# Altium schematic sheet SAMW25_Xplained_Pro_WIFI_module.SchDoc: Target MCU
size A3; Organization: ATMEL Norway; Address1: Vestre Rosten 79; Address2: N-7075 TILLER; Address3: NORWAY; DocumentNumber: A09-2449; Revision: 1; SheetNumber: 3; SheetTotal: 5; PageSetup: Record=PageOptions|CenterHorizontal=True|CenterVertical=True|PrintScale=1.01|XCorrection=1.00|YCorrection=1.00|PrintKind=1|BorderSize=5000000|LeftOffset=0|BottomOffset=0|Orientation=2|PaperLength=1000|PaperWidth=1000|Scale=100|PaperSource=7|PrintQuality=-4|MediaType=1|DitherType=10|PaperKind=A3 (297 x 420 mm)|PrintScaleMode=1
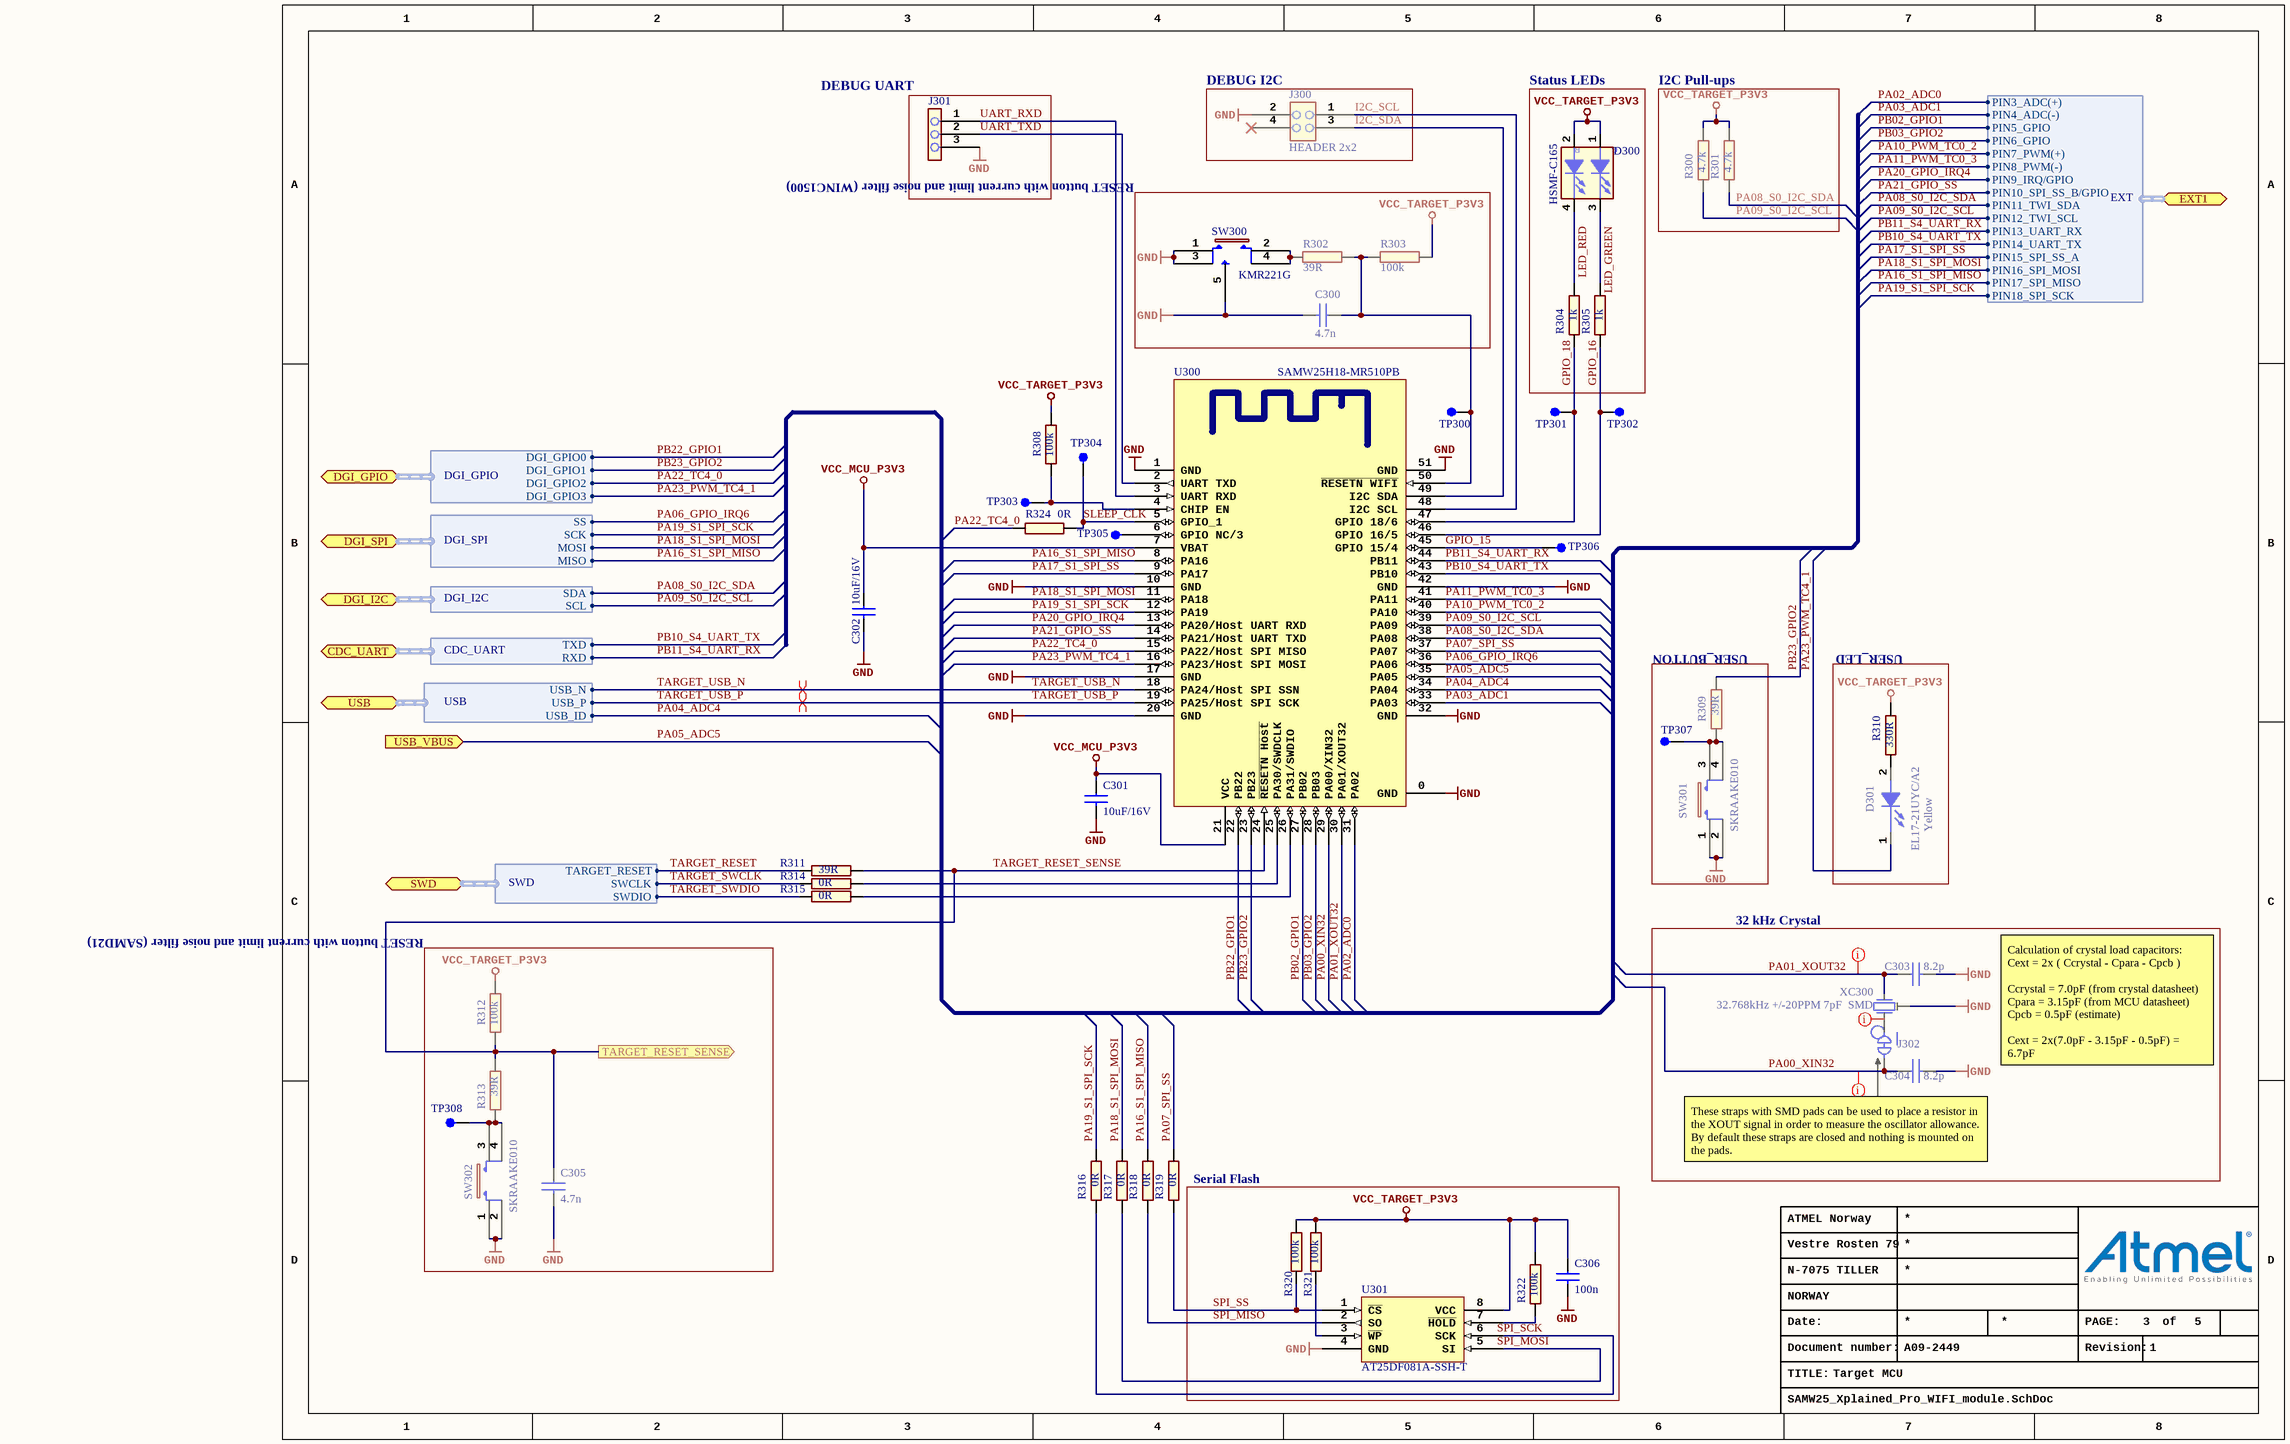
[diagram p0: SAMW25_Xplained_Pro_WIFI_module.SchDoc]

## Parts
C300  4.7n  [AP1-00001]
C301  value 10uF/16V  [AP1-00039]  (hidden comment: CAP-NONPOL)
C302  value 10uF/16V  [AP1-00039]  (hidden comment: CAP-NONPOL)
C303  value 8.2p  [AP1-00001]  (hidden comment: CAP-NONPOL)
C304  value 8.2p  [AP1-00001]  (hidden comment: CAP-NONPOL)
C305  4.7n  [AP1-00053]
C306  100n  [AP1-00001]
D300  value HSMF-C165  [AP4-00132]  (hidden comment: LED2_2)
D301  Yellow  value EL17-21UYC/A2  [AP4-00013]
J300  HEADER 2x2  [AP8-00179]
J301  Same as A08-1614 but with 1mm hole for optimal reflow soldering (no misalignment of the component)  [AP8-00745]  (value not drawn)
J302  SMD-STRAP_CLOSED  [AP8-00595]  (value not drawn)  (net tie, no BOM)
R300  value 4.7k  [AP2-00000]  (hidden comment: R2)
R301  value 4.7k  [AP2-00000]  (hidden comment: R2)
R302  value 39R  [AP2-00000]  (hidden comment: R2)
R303  value 100k  [AP2-00000]  (hidden comment: R2)
R304  value 1k  [AP2-00000]  (hidden comment: R2)
R305  value 1k  [AP2-00000]  (hidden comment: R2)
R308  value 100k  [AP2-00000]  (hidden comment: R2)
R309  value 39R  [AP2-00011]  (hidden comment: R2)
R310  value 330R  [AP2-00000]  (hidden comment: R2)
R311  value 39R  [AP2-00011]  (hidden comment: R2)
R312  value 100k  [AP2-00011]  (hidden comment: R2)
R313  value 39R  [AP2-00011]  (hidden comment: R2)
R314  value 0R  [AP2-00000]  (hidden comment: R2)
R315  value 0R  [AP2-00000]  (hidden comment: R2)
R316  value 0R  [AP2-00000]  (hidden comment: R2)
R317  value 0R  [AP2-00000]  (hidden comment: R2)
R318  value 0R  [AP2-00000]  (hidden comment: R2)
R319  value 0R  [AP2-00000]  (hidden comment: R2)
R320  value 100k  [AP2-00000]  (hidden comment: R2)
R321  value 100k  [AP2-00000]  (hidden comment: R2)
R322  value 100k  [AP2-00000]  (hidden comment: R2)
R324  value 0R  [AP2-00011]  (hidden comment: R2)
SW300  value KMR221G  [AP8-00274]  (hidden comment: PUSHBUTTON2)
SW301  value SKRAAKE010  [AP8-00137]  (hidden comment: Can be ordered in low volumes from Mouser)
SW302  value SKRAAKE010  [AP8-00137]  (hidden comment: Can be ordered in low volumes from Mouser)
TP300  TESTPOINT  [AP8-00256]  (value not drawn)  (no BOM)
TP301  TESTPOINT  [AP8-00256]  (value not drawn)  (no BOM)
TP302  TESTPOINT  [AP8-00256]  (value not drawn)  (no BOM)
TP303  TESTPOINT  [AP8-00256]  (value not drawn)  (no BOM)
TP304  TESTPOINT  [AP8-00256]  (value not drawn)  (no BOM)
TP305  TESTPOINT  [AP8-00256]  (value not drawn)  (no BOM)
TP306  TESTPOINT  [AP8-00256]  (value not drawn)  (no BOM)
TP307  TESTPOINT  [AP8-00010]  (value not drawn)  (no BOM)
TP308  TESTPOINT  [AP8-00010]  (value not drawn)  (no BOM)
U300  value SAMW25H18-MR510PB  [AP9-00132]  (hidden comment: MR210PA)
U301  value AT25DF081A-SSH-T  [AP8-00417]  (hidden comment: AT25DF081A)
XC300  value 32.768kHz +/-20PPM 7pF  SMD  [AP7-00044]  (hidden comment: Farnell order no:1539364)

## Blocks framed on the sheet
DEBUG I2C: J300
Status LEDs: D300 R304 R305
I2C Pull-ups: R300 R301
RESET button with current limit and noise filter (WINC1500): C300 R302 R303 SW300
USER_BUTTON: R309 SW301 TP307
USER_LED: D301 R310
RESET button with current limit and noise filter (SAMD21): C305 R312 R313 SW302 TP308
32 kHz Crystal: C303 C304 J302 XC300
Serial Flash: C306 R320-R322 U301

## Ports
CDC_UART (harness CDC_UART), DGI_GPIO (harness DGI_GPIO), DGI_I2C (harness DGI_I2C), DGI_SPI (harness DGI_SPI), EXT1 (harness EXT), SWD (harness SWD), TARGET_RESET_SENSE (out), USB (harness USB), USB_VBUS (in)

## Harnesses
DGI_GPIO: DGI_GPIO0, DGI_GPIO1, DGI_GPIO2, DGI_GPIO3
DGI_SPI: MISO, MOSI, SCK, SS
DGI_I2C: SCL, SDA
CDC_UART: RXD, TXD
SWD: SWCLK, SWDIO, TARGET_RESET
USB: USB_ID, USB_N, USB_P
EXT: PIN10_SPI_SS_B/GPIO, PIN11_TWI_SDA, PIN12_TWI_SCL, PIN13_UART_RX, PIN14_UART_TX, PIN15_SPI_SS_A, PIN16_SPI_MOSI, PIN17_SPI_MISO, PIN18_SPI_SCK, PIN3_ADC(+), PIN4_ADC(-), PIN5_GPIO, PIN6_GPIO, PIN7_PWM(+), PIN8_PWM(-), PIN9_IRQ/GPIO

## Nets
GND: C300.2 C301.2 C302.2 C303.2 C304.2 C305.2 C306.2 J300.2 J301.3 SW300.1 SW300.3 SW300.5(GND) SW301.1 SW301.2 SW302.1 SW302.2 U300.0(GND) U300.1(GND) U300.10(GND) U300.17(GND) U300.20(GND) U300.32(GND) U300.42(GND) U300.51(GND) U301.4(GND) XC300.3
VCC_MCU_P3V3: C301.1 C302.1 U300.7(VBAT) U300.21(VCC)
VCC_TARGET_P3V3: C306.1 D300.1(ANODE1) D300.2(ANODE2) R300.1 R301.1 R303.2 R308.2 R310.2 R312.2 R320.1 R321.1 R322.2 U301.8(VCC)
GPIO_15: TP306.1 U300.45(GPIO_15/4)
GPIO_16: R305.2 TP302.1 U300.46(GPIO_16/5)
GPIO_18: R304.2 TP301.1 U300.47(GPIO_18/6)
I2C_SCL: J300.1 U300.48(I2C_SCL)
I2C_SDA: J300.3 U300.49(I2C_SDA)
LED_GREEN: D300.3(CATHODE3) R305.1
LED_RED: D300.4(CATHODE4) R304.1
PA00_XIN32: C304.1 J302.2 U300.29(PA00/XIN32)
PA01_XOUT32: C303.1 U300.30(PA01/XOUT32) XC300.1
PA02_ADC0: U300.31(PA02) ; port EXT1.PIN3_ADC(+)
PA03_ADC1: U300.33(PA03) ; port EXT1.PIN4_ADC(-)
PA04_ADC4: U300.34(PA04) ; port USB.USB_ID
PA05_ADC5: U300.35(PA05) ; port USB_VBUS
PA06_GPIO_IRQ6: U300.36(PA06) ; port DGI_SPI.SS
PA07_SPI_SS: R319.2 U300.37(PA07)
PA08_S0_I2C_SDA: R301.2 U300.38(PA08) ; port DGI_I2C.SDA, port EXT1.PIN11_TWI_SDA
PA09_S0_I2C_SCL: R300.2 U300.39(PA09) ; port DGI_I2C.SCL, port EXT1.PIN12_TWI_SCL
PA10_PWM_TC0_2: U300.40(PA10) ; port EXT1.PIN7_PWM(+)
PA11_PWM_TC0_3: U300.41(PA11) ; port EXT1.PIN8_PWM(-)
PA16_S1_SPI_MISO: R318.2 U300.8(PA16) ; port DGI_SPI.MISO, port EXT1.PIN17_SPI_MISO
PA17_S1_SPI_SS: U300.9(PA17) ; port EXT1.PIN15_SPI_SS_A
PA18_S1_SPI_MOSI: R317.2 U300.11(PA18) ; port DGI_SPI.MOSI, port EXT1.PIN16_SPI_MOSI
PA19_S1_SPI_SCK: R316.2 U300.12(PA19) ; port DGI_SPI.SCK, port EXT1.PIN18_SPI_SCK
PA20_GPIO_IRQ4: U300.13(PA20/Host_UART_RXD) ; port EXT1.PIN9_IRQ/GPIO
PA21_GPIO_SS: U300.14(PA21/Host_UART_TXD) ; port EXT1.PIN10_SPI_SS_B/GPIO
PA22_TC4_0: R324.1 U300.15(PA22/Host_SPI_MISO) ; port DGI_GPIO.DGI_GPIO2
PA23_PWM_TC4_1: D301.1(CATHODE) U300.16(PA23/Host_SPI_MOSI) ; port DGI_GPIO.DGI_GPIO3
PB02_GPIO1: U300.27(PB02) ; port EXT1.PIN5_GPIO
PB03_GPIO2: U300.28(PB03) ; port EXT1.PIN6_GPIO
PB10_S4_UART_TX: U300.43(PB10) ; port CDC_UART.TXD, port EXT1.PIN14_UART_TX
PB11_S4_UART_RX: U300.44(PB11) ; port CDC_UART.RXD, port EXT1.PIN13_UART_RX
PB22_GPIO1: U300.22(PB22) ; port DGI_GPIO.DGI_GPIO0
PB23_GPIO2: R309.2 U300.23(PB23) ; port DGI_GPIO.DGI_GPIO1
SLEEP_CLK: R324.2 TP304.1 U300.5(GPIO_1)
SPI_MISO: R318.1 U301.2(SO)
SPI_SS: R319.1 R320.2 U301.1(~{CS})
TARGET_RESET: R311.1 ; port SWD.TARGET_RESET
TARGET_RESET_SENSE: C305.1 R311.2 R312.1 R313.2 U300.24(~{RESETN_Host}) ; port TARGET_RESET_SENSE
TARGET_SWCLK: R314.1 ; port SWD.SWCLK
TARGET_SWDIO: R315.1 ; port SWD.SWDIO
TARGET_USB_N: U300.18(PA24/Host_SPI_SSN) ; port USB.USB_N
TARGET_USB_P: U300.19(PA25/Host_SPI_SCK) ; port USB.USB_P
UART_RXD: J301.1 U300.3(UART_RXD)
UART_TXD: J301.2 U300.2(UART_TXD)
NetC300_1: C300.1 R302.2 R303.1 TP300.1 U300.50(~{RESETN_WIFI})
NetD301_2: D301.2(ANODE) R310.1
NetJ302_1: J302.1 XC300.2
NetR302_1: R302.1 SW300.2 SW300.4
NetR308_1: R308.1 TP303.1 U300.4(CHIP_EN)
NetR309_1: R309.1 SW301.3 SW301.4 TP307.1
NetR313_1: R313.1 SW302.3 SW302.4 TP308.1
NetR314_2: R314.2 U300.25(PA30/SWDCLK)
NetR315_2: R315.2 U300.26(PA31/SWDIO)
NetR316_1: R316.1 U301.6(SCK)
NetR317_1: R317.1 U301.5(SI)
NetR321_2: R321.2 U301.3(~{WP})
NetR322_1: R322.1 U301.7(~{HOLD})
NetTP305_1: TP305.1 U300.6(GPIO_NC/3)

Not connected (* = marked no-connect by the designer): J300 4*

## Layout directives
rule Assembly Testpoint Usage [Testpoint - Not Allowed    Multiple - Not Allowed]: NetJ302_1, PA00_XIN32, PA01_XOUT32
differential pair; rule Assembly Testpoint Usage [Testpoint - Not Allowed    Multiple - Not Allowed]: TARGET_USB_N, TARGET_USB_P

## Notes on the sheet
- (near J301) DEBUG UART
- Calculation of crystal load capacitors:
  Cext = 2x ( Ccrystal - Cpara - Cpcb )
  Ccrystal = 7.0pF (from crystal datasheet)
  Cpara = 3.15pF (from MCU datasheet)
  Cpcb = 0.5pF (estimate)
  Cext = 2x(7.0pF - 3.15pF - 0.5pF) = 6.7pF
- These straps with SMD pads can be used to place a resistor in the XOUT signal in order to measure the oscillator allowance.
  By default these straps are closed and nothing is mounted on the pads.
- Labels drawn without touching a wire or pin: SPI_MOSI, SPI_SCK
- Date:
- PAGE:
- of
- TITLE:
- Document number:
- Revision:
- (in symbol A10-0154) R; G

## Library data of the parts
C300 C305 = A01-0539: Ceramic capacitor, SMD 0402, X7R, 16V, +/-10 %; PartGroup: Capacitors,Ceramic,SMD 0402; Manufacturer: NIC Components Corp.; MPN: NMC0402X7R472K25TRPF; TemperatureRange: -55°C to +125°C; ComponentStatus: 'Active (verified)'; Status: Active; Verified by: Lars Helge Mo; Verified date: 2005-12-15; AN: A01-0539; Value: 4.7n; Height: 0.600000023841858; FootprintStatus: 'Active (Verified)'
C301 C302 = A01-0491: Ceramic capacitor, SMD 0603, X5R, 16V, 10UF ± 20% (High Density); PartGroup: Capacitors,Ceramic,SMD 0603; Manufacturer: Taiyo Yuden; MPN: EMK107BBJ106MA-T; Tolerance: ­± 20%; TemperatureRange: -55°C to +85°C; ComponentStatus: 'Active (verified)'; Status: Active; Verified by: Lars Helge Mo; Verified date: 2005-12-15; AN: A01-0491; Height: 0.819999992847443; FootprintStatus: 'Active (Verified)'
C303 C304 = A01-0014: Ceramic capacitor, SMD 0402, NP0, 50V, +/-5%; PartGroup: Capacitors,Ceramic,SMD 0402; TemperatureRange: -55 - +125 deg C; ComponentStatus: 'Active (verified)'; Status: Active; Verified by: Lars Helge Mo; Verified date: 2005-12-15; AN: A01-0014; Tolerance: 50V, +/-5%; Height: 0.550000011920929; FootprintStatus: 'Active (Verified)'
C306 = A01-0246: Ceramic capacitor, SMD 0402, X7R, 16V, +/-10%; PartGroup: Capacitors,Ceramic,SMD 0402; Manufacturer: Kemet; MPN: C0402C104K4RACTU; TemperatureRange: -55 - +125 deg C; ComponentStatus: 'Active (verified)'; Status: Active; Verified by: Lars Helge Mo; Verified date: 2005-12-15; AN: A01-0246; Value: 100n; Tolerance: 16V, +/-10%; Height: 0,5; FootprintStatus: 'Active (Verified)'
D300 = A10-0154: LED, Bicolor, Red/Green, Diffused, 1.6 x 0.8 mm (0603); PartGroup: Opto,LEDs,SMD; Manufacturer: Avago Technologies; TemperatureRange: -30Â°C to 85Â°C; ComponentStatus: 'Active (verified)'; AN: A10-0154; Height: 0.5; MPN: HSMF-C165; FootprintStatus: 'Active (Verified)'
D301 = A10-0019: LED, Yellow, Wave length=591nm, SMD 0805, ±70°; PartGroup: Opto,LEDs,SMD; Manufacturer: Everlight; MPN: 17-21UYC/S530-A3/TR8; TemperatureRange: -40 to +85 deg C; ComponentStatus: 'Active (verified)'; Verified date: 2006-02-17; Verified by: Sveinung Helgeland; Status: Active; AN: A10-0019; Height: 1,10000002384186; FootprintStatus: 'Active (Verified)'
J300 = A08-0115: 2x2 pin header, 2.54 mm pitch, Pin-in-Paste THM; PartGroup: Mechanical devices,Connectors,Pin headers; Manufacturer: Freber; Value: CD0750142X2; ComponentStatus: 'Active (verified)'; Verified date: 2005-12-19; Verified by: Lars Helge Mo; Status: Active; AN: A08-0115; Height: 9.60000038146973; MPN: CD0750142X2; FootprintStatus: 'Active (Verified)'
J301 = A08-1799: 1x3 pin header, 2.54mm pitch, Pin-in-Paste THM, 1mm hole; PartGroup: Mechanical devices,Connectors,Pin headers; Manufacturer: SAMTEC; Value: HMTSW-103-23-F-S-237; ComponentStatus: 'Active (verified)'; Verified date: 2006-01-30; Verified by: Lars Helge Mo; Status: Active; AN: A08-1799; Height: 6.09999990463257; MPN: HMTSW-103-23-F-S-237; FootprintStatus: 'Active (Verified)'
J302 = A08-1454: Closed Link 0402; PartGroup: Mechanical devices,PCB implemented components; ComponentStatus: 'Active (verified)'; AN: A08-1454; Value: Closed Link; FootprintStatus: 'New (Not verified)'
R300 R301 = A02-0228: Thick film resistor, SMD 0402, 1/16W, 1%; PartGroup: Resistors,SMD,0402 1%; TemperatureRange: -55ï¿½ to +125ï¿½C; ComponentStatus: 'Active (verified)'; Status: Active; Verified by: Lars Helge Mo; Verified date: 2005-12-19; AN: A02-0228; Tolerance: 1 %; Height: 0,349999994039536; FootprintStatus: 'Active (Verified)'
R302 R309 R311 R313 = A02-0178: Thick film resistor, SMD 0402, 1/16W, 1%; PartGroup: Resistors,SMD,0402 1%; TemperatureRange: -55 - +125 deg C; ComponentStatus: 'Active (verified)'; Status: Active; Verified by: Lars Helge Mo; Verified date: 2005-12-19; AN: A02-0178; Tolerance: 1 %; Height: 0,349999994039536; FootprintStatus: 'Active (Verified)'
R303 R308 R312 R320-R322 = A02-0260: Thick film resistor, SMD 0402, 1/16W, 1%; PartGroup: Resistors,SMD,0402 1%; TemperatureRange: -55 - +125 deg C; ComponentStatus: 'Active (verified)'; Status: Active; Verified by: Lars Helge Mo; Verified date: 2005-12-19; AN: A02-0260; Tolerance: 1 %; Height: 0,349999994039536; FootprintStatus: 'Active (Verified)'
R304 R305 = A02-0212: Thick film resistor, SMD 0402, 1/16W, 1%; PartGroup: Resistors,SMD,0402 1%; TemperatureRange: -55 - +125 deg C; ComponentStatus: 'Active (verified)'; Status: Active; Verified by: Lars Helge Mo; Verified date: 2005-12-19; AN: A02-0212; Tolerance: 1 %; Height: 0.349999994039536; FootprintStatus: 'Active (Verified)'
R310 = A02-0200: Thick film resistor, SMD 0402, 1/16W, 1%; PartGroup: Resistors,SMD,0402 1%; TemperatureRange: -55 - +125 deg C; ComponentStatus: 'Active (verified)'; Status: Active; Verified by: Lars Helge Mo; Verified date: 2005-12-19; AN: A02-0200; Tolerance: 1 %; Height: 0.349999994039536; FootprintStatus: 'Active (Verified)'
R314-R319 = A02-0163: RES 0.0 OHM 1/16W 0402 SMD; PartGroup: Resistors,SMD,0402 1%; MPN: RMCF0402ZT0R00; Tolerance: 1 %; TemperatureRange: -55 - +125 deg C; ComponentStatus: 'Active (verified)'; Status: Active; Verified by: Lars Helge Mo; Verified date: 2005-12-19; AN: A02-0163; Height: 0.349999994039536; FootprintStatus: 'Active (Verified)'
R324 = A02-0163: Thick film resistor, SMD 0402, 1/16W, 1%; PartGroup: Resistors,SMD,0402 1%; TemperatureRange: -55 - +125 deg C; ComponentStatus: 'Active (verified)'; Status: Active; Verified by: Lars Helge Mo; Verified date: 2005-12-19; AN: A02-0163; Tolerance: 1 %; Height: 0.349999994039536; FootprintStatus: 'Active (Verified)'
SW300 = A08-0420: Microminiature Tact Switch for SMT; PartGroup: Mechanical devices,Switches,SMD; Manufacturer: ITT cannon; ComponentStatus: 'Active (verified)'; Status: Active; Verified by: Ketil Skjerve; Verified date: 2006-03-15; AN: A08-0420; Height: 1.89999997615814; MPN: KMR221G; FootprintStatus: 'Active (Verified)'
SW301 SW302 = A08-0790: 6.2x6.2 mm SMD tact switch, same as A08-0091 but less force is needed; PartGroup: Mechanical devices,Switches,SMD; Manufacturer: ALPS; TemperatureRange: -30 - +90 deg C; ComponentStatus: 'Active (verified)'; Status: Active; Verified by: Ketil Skjerve; Verified date: 2006-03-15; AN: A08-0790; Height: 5,09999990463257; MPN: SKRAAKE010; FootprintStatus: 'Active (Verified)'
TP300-TP306 = A09-0290: Hole for user grid with 1.27 mm pitch, 1x1 mm pad; PartGroup: Mechanical devices,PCB implemented components,PCB Screw Hole components; Value: Hole 0.65 mm; ComponentStatus: 'Active (verified)'; Status: Active; Verified by: Sveinung Helgeland; Verified date: 2006-02-17; AN: A09-0290; FootprintStatus: 'Active (Verified)'
TP307 TP308 = A08-0004: Single SMD testpad; PartGroup: Mechanical devices,Connectors,Test points; ComponentStatus: 'Active (verified)'; Status: Active; Verified by: Sveinung Helgeland; Verified date: 2006-02-17; AN: A08-0004; Height: 0; FootprintStatus: 'Active (Verified)'
U300 = A06-1267: IEEE 802.11 b/g/n module with onboard SAMD21G18A-MU and Crypto IC; PartGroup: Integrated Circuits,MCU, MPU, DSP,Other; Manufacturer: ATMEL; MPN: ATSAMW25H18-MR510PB; TemperatureRange: -20 to 85 C; ComponentStatus: 'Active (verified)'; AN: A06-1267; FootprintStatus: 'New (Not verified)'
U301 = A06-1051: 8Mbit SPI serial flash memory; PartGroup: Integrated Circuits,Memory,FLASH; Manufacturer: Adesto Technologies; TemperatureRange: -40°C to +85°C; ComponentStatus: 'Active (verified)'; AN: A06-1051; Height: 1.75; MPN: AT25DF081A-SSH-T; FootprintStatus: 'Active (Verified)'
XC300 = A07-0052: 32k768 crystal, +-20ppm, CL=7pF, max ESR 60kOhm, SMD; PartGroup: Frequency devices,Crystals,SMD; Manufacturer: Micro Crystal; MPN: MS1V-T1K 32.768kHz 7pF +/-20PPM TA; Tolerance: +/- 20 PPM; TemperatureRange: -40 /+85; ComponentStatus: 'Active (verified)'; AN: A07-0052; Height: 2,07999992370605; FootprintStatus: 'Active (Verified)'